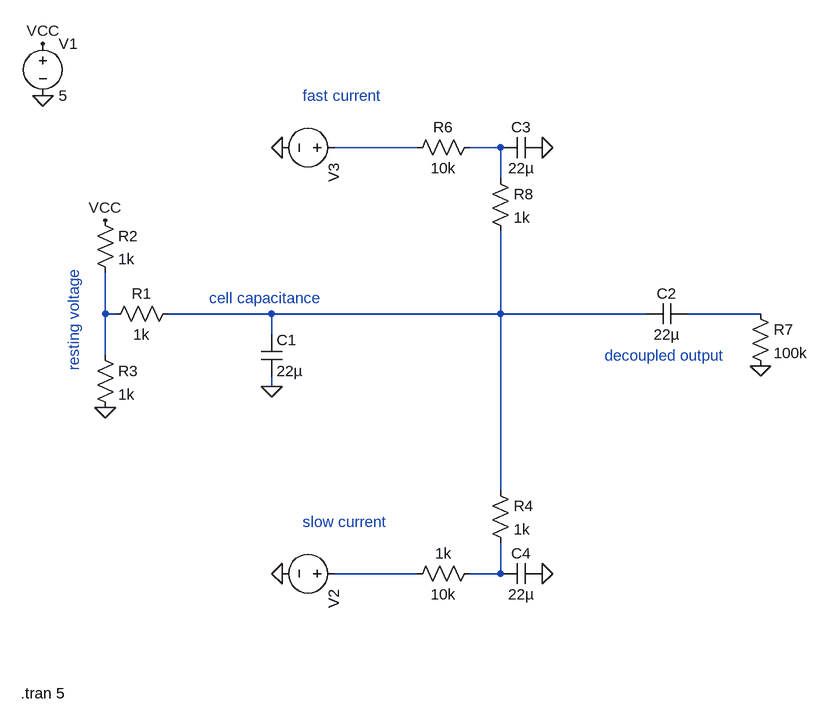
[diagram p0: schematic idea-1.asc]
idea-1.asc, the LTspice schematic file:
Version 4
SHEET 1 880 680
WIRE 112 -192 -16 -192
WIRE 240 -192 192 -192
WIRE 240 -144 240 -192
WIRE -368 64 -368 0
WIRE -352 64 -368 64
WIRE -112 64 -272 64
WIRE 240 64 240 -64
WIRE 240 64 -112 64
WIRE 464 64 240 64
WIRE 640 64 528 64
WIRE -112 96 -112 64
WIRE -368 128 -368 64
WIRE -112 176 -112 160
WIRE 240 336 240 64
WIRE 112 464 -16 464
WIRE 240 464 240 416
WIRE 240 464 192 464
FLAG -368 208 0
FLAG -464 -272 0
FLAG -464 -352 VCC
FLAG -368 -80 VCC
FLAG -112 176 0
FLAG -96 464 0
FLAG 640 144 0
FLAG -96 -192 0
FLAG 304 -192 0
FLAG 304 464 0
SYMBOL res -256 48 R90
WINDOW 0 0 56 VBottom 2
WINDOW 3 32 56 VTop 2
SYMATTR InstName R1
SYMATTR Value 1k
SYMBOL res -384 -96 R0
SYMATTR InstName R2
SYMATTR Value 1k
SYMBOL res -384 112 R0
SYMATTR InstName R3
SYMATTR Value 1k
SYMBOL voltage -464 -368 R0
WINDOW 123 0 0 Left 2
WINDOW 39 0 0 Left 2
SYMATTR InstName V1
SYMATTR Value 5
SYMBOL cap -128 96 R0
SYMATTR InstName C1
SYMATTR Value 22µ
SYMBOL voltage 0 464 R90
WINDOW 3 24 96 Invisible 2
WINDOW 123 0 0 Left 2
WINDOW 39 0 0 Left 2
SYMATTR InstName V2
SYMATTR Value PULSE(5 0 .51 .00001 .00001 .001 1)
SYMBOL cap 528 48 R90
WINDOW 0 0 32 VBottom 2
WINDOW 3 32 32 VTop 2
SYMATTR InstName C2
SYMATTR Value 22µ
SYMBOL res 624 48 R0
SYMATTR InstName R7
SYMATTR Value 100k
SYMBOL res 224 320 R0
SYMATTR InstName R4
SYMATTR Value 1k
SYMBOL voltage 0 -192 R90
WINDOW 3 24 96 Invisible 2
WINDOW 123 0 0 Left 2
WINDOW 39 0 0 Left 2
SYMATTR InstName V3
SYMATTR Value PULSE(0 5 .5 .00001 .00001 .001 1)
SYMBOL res 224 -160 R0
SYMATTR InstName R8
SYMATTR Value 1k
SYMBOL res 208 448 R90
WINDOW 0 0 56 VBottom 2
WINDOW 3 32 56 VTop 2
SYMATTR InstName 1k
SYMATTR Value 10k
SYMBOL res 208 -208 R90
WINDOW 0 0 56 VBottom 2
WINDOW 3 32 56 VTop 2
SYMATTR InstName R6
SYMATTR Value 10k
SYMBOL cap 304 -208 R90
WINDOW 0 0 32 VBottom 2
WINDOW 3 32 32 VTop 2
SYMATTR InstName C3
SYMATTR Value 22µ
SYMBOL cap 304 448 R90
WINDOW 0 0 32 VBottom 2
WINDOW 3 32 32 VTop 2
SYMATTR InstName C4
SYMATTR Value 22µ
TEXT -416 152 VLeft 2 ;resting voltage
TEXT -208 40 Left 2 ;cell capacitance
TEXT -498 648 Left 2 !.tran 5
TEXT 400 128 Left 2 ;decoupled output
TEXT -64 384 Left 2 ;slow current
TEXT -64 -272 Left 2 ;fast current

The netlist it stands for:
* idea-1.asc
R1 N004 N003 1k
R2 VCC N003 1k
R3 N003 0 1k
V1 VCC 0 5
C1 N004 0 22µ
V2 N006 0 PULSE(5 0 .51 .00001 .00001 .001 1)
C2 N005 N004 22µ
R7 N005 0 100k
R4 N004 N007 1k
V3 N001 0 PULSE(0 5 .5 .00001 .00001 .001 1)
R8 N002 N004 1k
R§1k N007 N006 10k
R6 N002 N001 10k
C3 0 N002 22µ
C4 0 N007 22µ
* resting voltage
* cell capacitance
.tran 5
* decoupled output
* slow current
* fast current
.backanno
.end